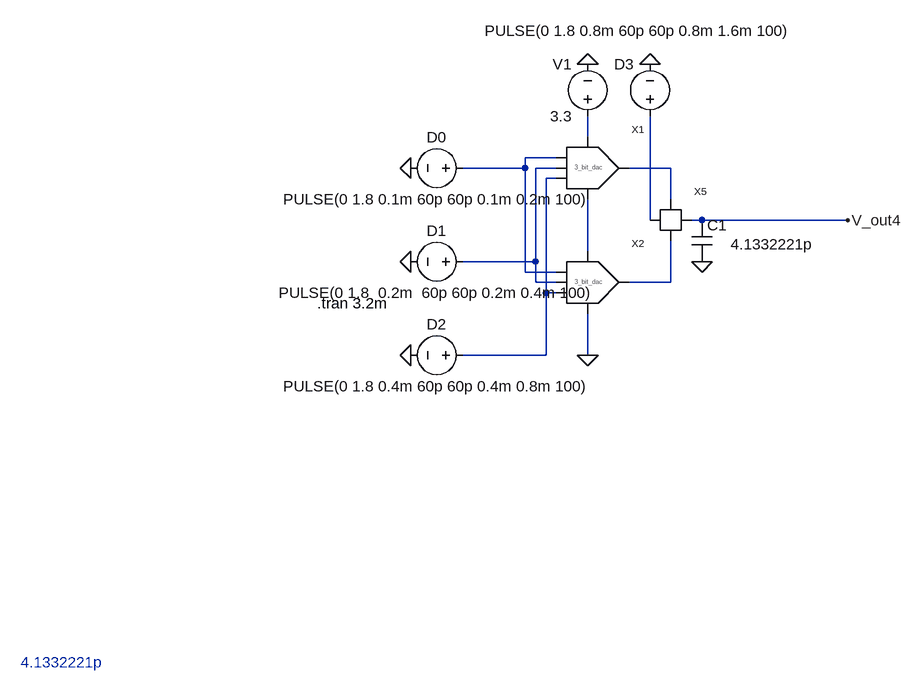
[diagram p0: schematic 4_bit_dac.asc]
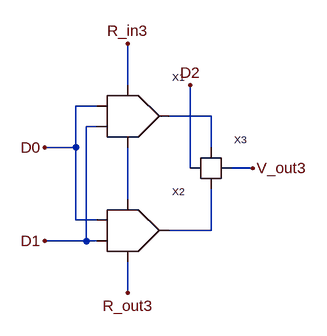
[diagram p1: sub-circuit 3_bit_dac.asc]
4_bit_dac.asc, the LTspice schematic file:
Version 4
SHEET 1 880 776
WIRE 160 -48 160 -80
WIRE 112 -16 64 -16
WIRE 64 0 64 -16
WIRE 64 0 -32 0
WIRE 112 0 80 0
WIRE 288 0 224 0
WIRE 112 16 96 16
WIRE 288 48 288 0
WIRE 256 80 256 -80
WIRE 336 80 320 80
WIRE 560 80 336 80
WIRE 160 128 160 48
WIRE 80 144 80 0
WIRE 80 144 -32 144
WIRE 64 160 64 0
WIRE 112 160 64 160
WIRE 80 176 80 144
WIRE 112 176 80 176
WIRE 288 176 288 112
WIRE 288 176 224 176
WIRE 96 192 96 16
WIRE 112 192 96 192
WIRE 96 288 96 192
WIRE 96 288 -32 288
WIRE 160 288 160 224
FLAG 160 -160 0
FLAG -112 0 0
FLAG -112 144 0
FLAG 560 80 V_out4
FLAG 256 -160 0
FLAG -112 288 0
FLAG 160 288 0
FLAG 336 144 0
SYMBOL 3_bit_dac 176 0 R0
SYMATTR InstName X1
SYMBOL 3_bit_dac 176 176 R0
SYMATTR InstName X2
SYMBOL switch 288 80 R0
SYMATTR InstName X5
SYMBOL voltage 160 -64 R180
WINDOW 0 24 96 Left 2
WINDOW 3 24 16 Left 2
WINDOW 123 0 0 Left 0
WINDOW 39 0 0 Left 0
SYMATTR InstName V1
SYMATTR Value 3.3
SYMBOL voltage -16 0 R90
WINDOW 0 -32 56 VBottom 2
WINDOW 3 32 56 VTop 2
WINDOW 123 0 0 Left 0
WINDOW 39 0 0 Left 0
SYMATTR InstName D0
SYMATTR Value PULSE(0 1.8 0.1m 60p 60p 0.1m 0.2m 100)
SYMBOL voltage -16 144 R90
WINDOW 0 -32 56 VBottom 2
WINDOW 3 32 56 VTop 2
WINDOW 123 0 0 Left 0
WINDOW 39 0 0 Left 0
SYMATTR InstName D1
SYMATTR Value PULSE(0 1.8  0.2m  60p 60p 0.2m 0.4m 100)
SYMBOL voltage 256 -64 R180
WINDOW 0 24 96 Left 2
WINDOW 3 -218 147 Left 2
WINDOW 123 0 0 Left 0
WINDOW 39 0 0 Left 0
SYMATTR InstName D3
SYMATTR Value PULSE(0 1.8 0.8m 60p 60p 0.8m 1.6m 100)
SYMBOL voltage -16 288 R90
WINDOW 0 -32 56 VBottom 2
WINDOW 3 32 56 VTop 2
WINDOW 123 0 0 Left 0
WINDOW 39 0 0 Left 0
SYMATTR InstName D2
SYMATTR Value PULSE(0 1.8 0.4m 60p 60p 0.4m 0.8m 100)
SYMBOL cap 320 80 R0
WINDOW 3 60 37 Left 2
SYMATTR Value 4.1332221p
SYMATTR InstName C1
TEXT -256 208 Left 2 !.tran 3.2m
TEXT -712 760 Left 2 ;4.1332221p

3_bit_dac.asc, the sub-circuit schematic file:
Version 4
SHEET 1 880 680
WIRE 160 48 160 -16
WIRE 112 80 80 80
WIRE 288 96 224 96
WIRE 112 112 96 112
WIRE 80 144 80 80
WIRE 80 144 32 144
WIRE 288 144 288 96
WIRE 256 176 256 48
WIRE 352 176 320 176
WIRE 160 224 160 144
WIRE 80 256 80 144
WIRE 112 256 80 256
WIRE 288 272 288 208
WIRE 288 272 224 272
WIRE 96 288 96 112
WIRE 96 288 32 288
WIRE 112 288 96 288
WIRE 160 368 160 320
FLAG 352 176 V_out3
FLAG 32 144 D0
FLAG 32 288 D1
FLAG 160 -16 R_in3
FLAG 160 368 R_out3
FLAG 256 48 D2
SYMBOL 2_bit_dac 160 96 R0
SYMATTR InstName X1
SYMBOL 2_bit_dac 160 272 R0
SYMATTR InstName X2
SYMBOL switch 288 176 R0
SYMATTR InstName X3

The netlist it stands for:
* 4_bit_dac.asc
XX1 N002 N003 N005 N001 N007 N004 3_bit_dac
XX2 N002 N003 N005 N007 0 N008 3_bit_dac
XX5 N006 N004 N008 V_out4 switch  ; pins digital_input Vin_1 Vin_2 Vout
V1 N001 0 3.3
V§D0 N002 0 PULSE(0 1.8 0.1m 60p 60p 0.1m 0.2m 100)
V§D1 N003 0 PULSE(0 1.8  0.2m  60p 60p 0.2m 0.4m 100)
V§D3 N006 0 PULSE(0 1.8 0.8m 60p 60p 0.8m 1.6m 100)
V§D2 N005 0 PULSE(0 1.8 0.4m 60p 60p 0.4m 0.8m 100)
C1 V_out4 0 4.1332221p

* block symbol definitions
.subckt 3_bit_dac D0 D1 D2 R_in3 R_out3 V_out3
XX1 D0 D1 R_in3 N002 N001 2_bit_dac  ; pins D0 D1 R_in2 R_out2 V_out2
XX2 D0 D1 N002 R_out3 N003 2_bit_dac  ; pins D0 D1 R_in2 R_out2 V_out2
XX3 D2 N001 N003 V_out3 switch  ; pins digital_input Vin_1 Vin_2 Vout
.ends 3_bit_dac

.tran 3.2m
* 4.1332221p
.backanno
.end